# EAGLE schematic controller (EAGLE 6.6.0)

## Sheet 1 of 3: ESP
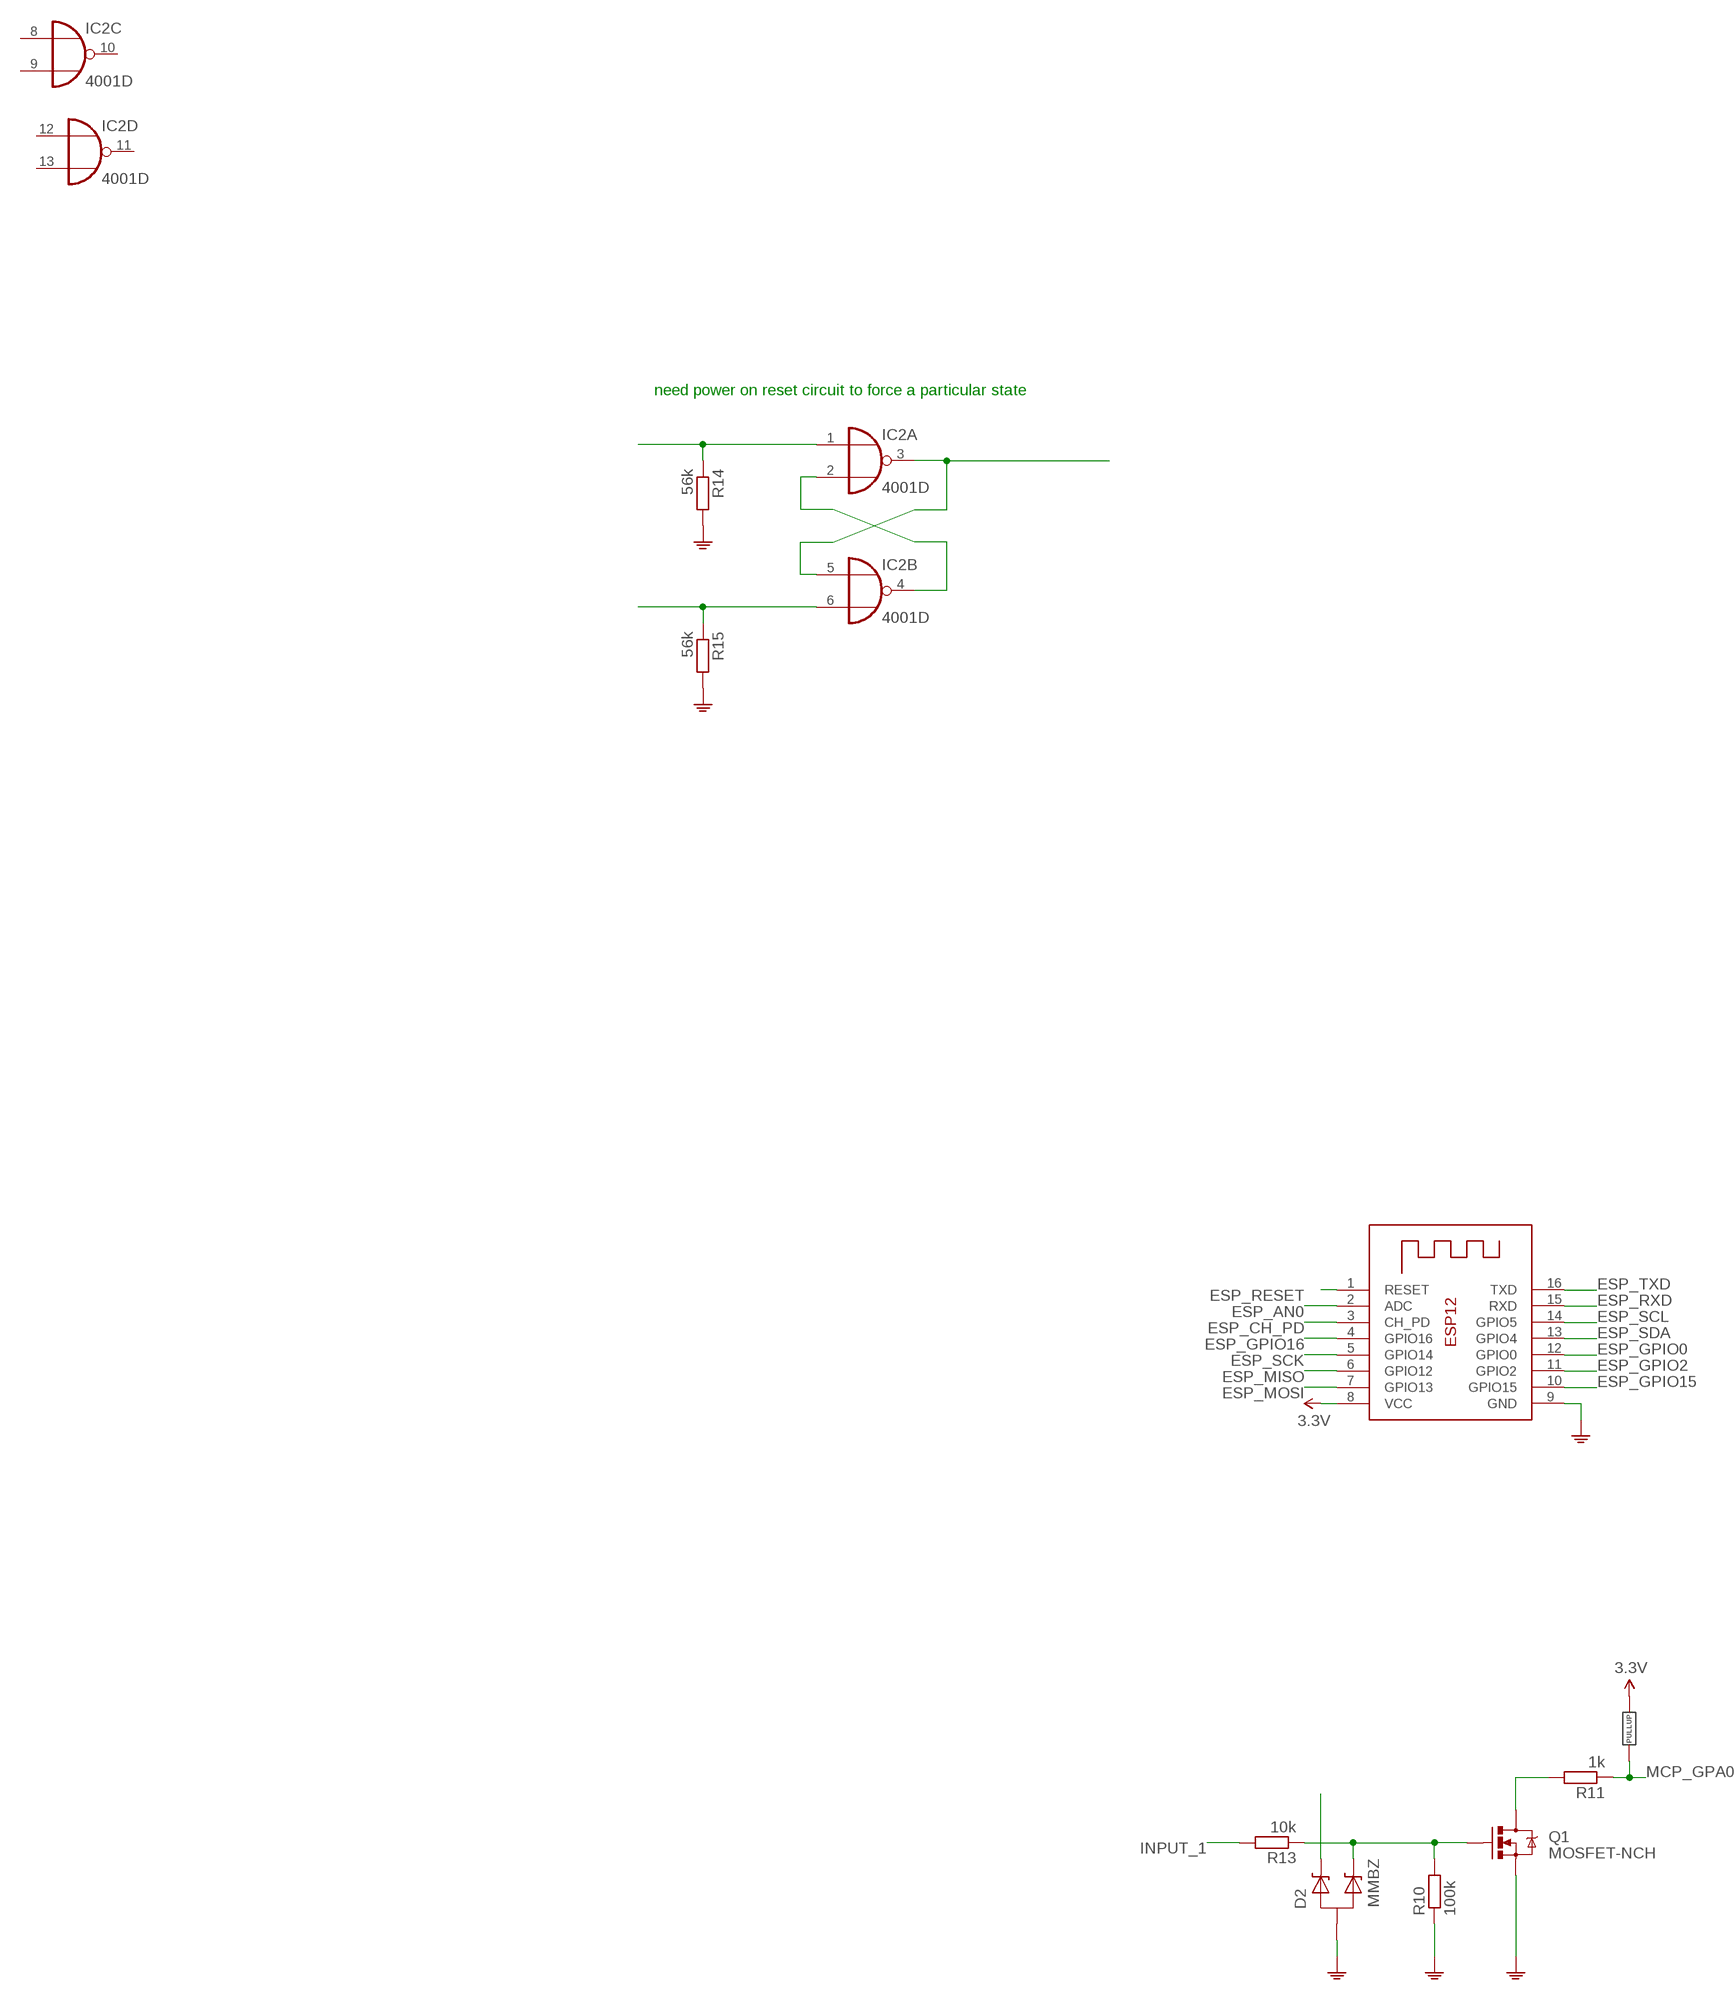
[diagram p0: schematic, sheet 1, part 1 of 2]
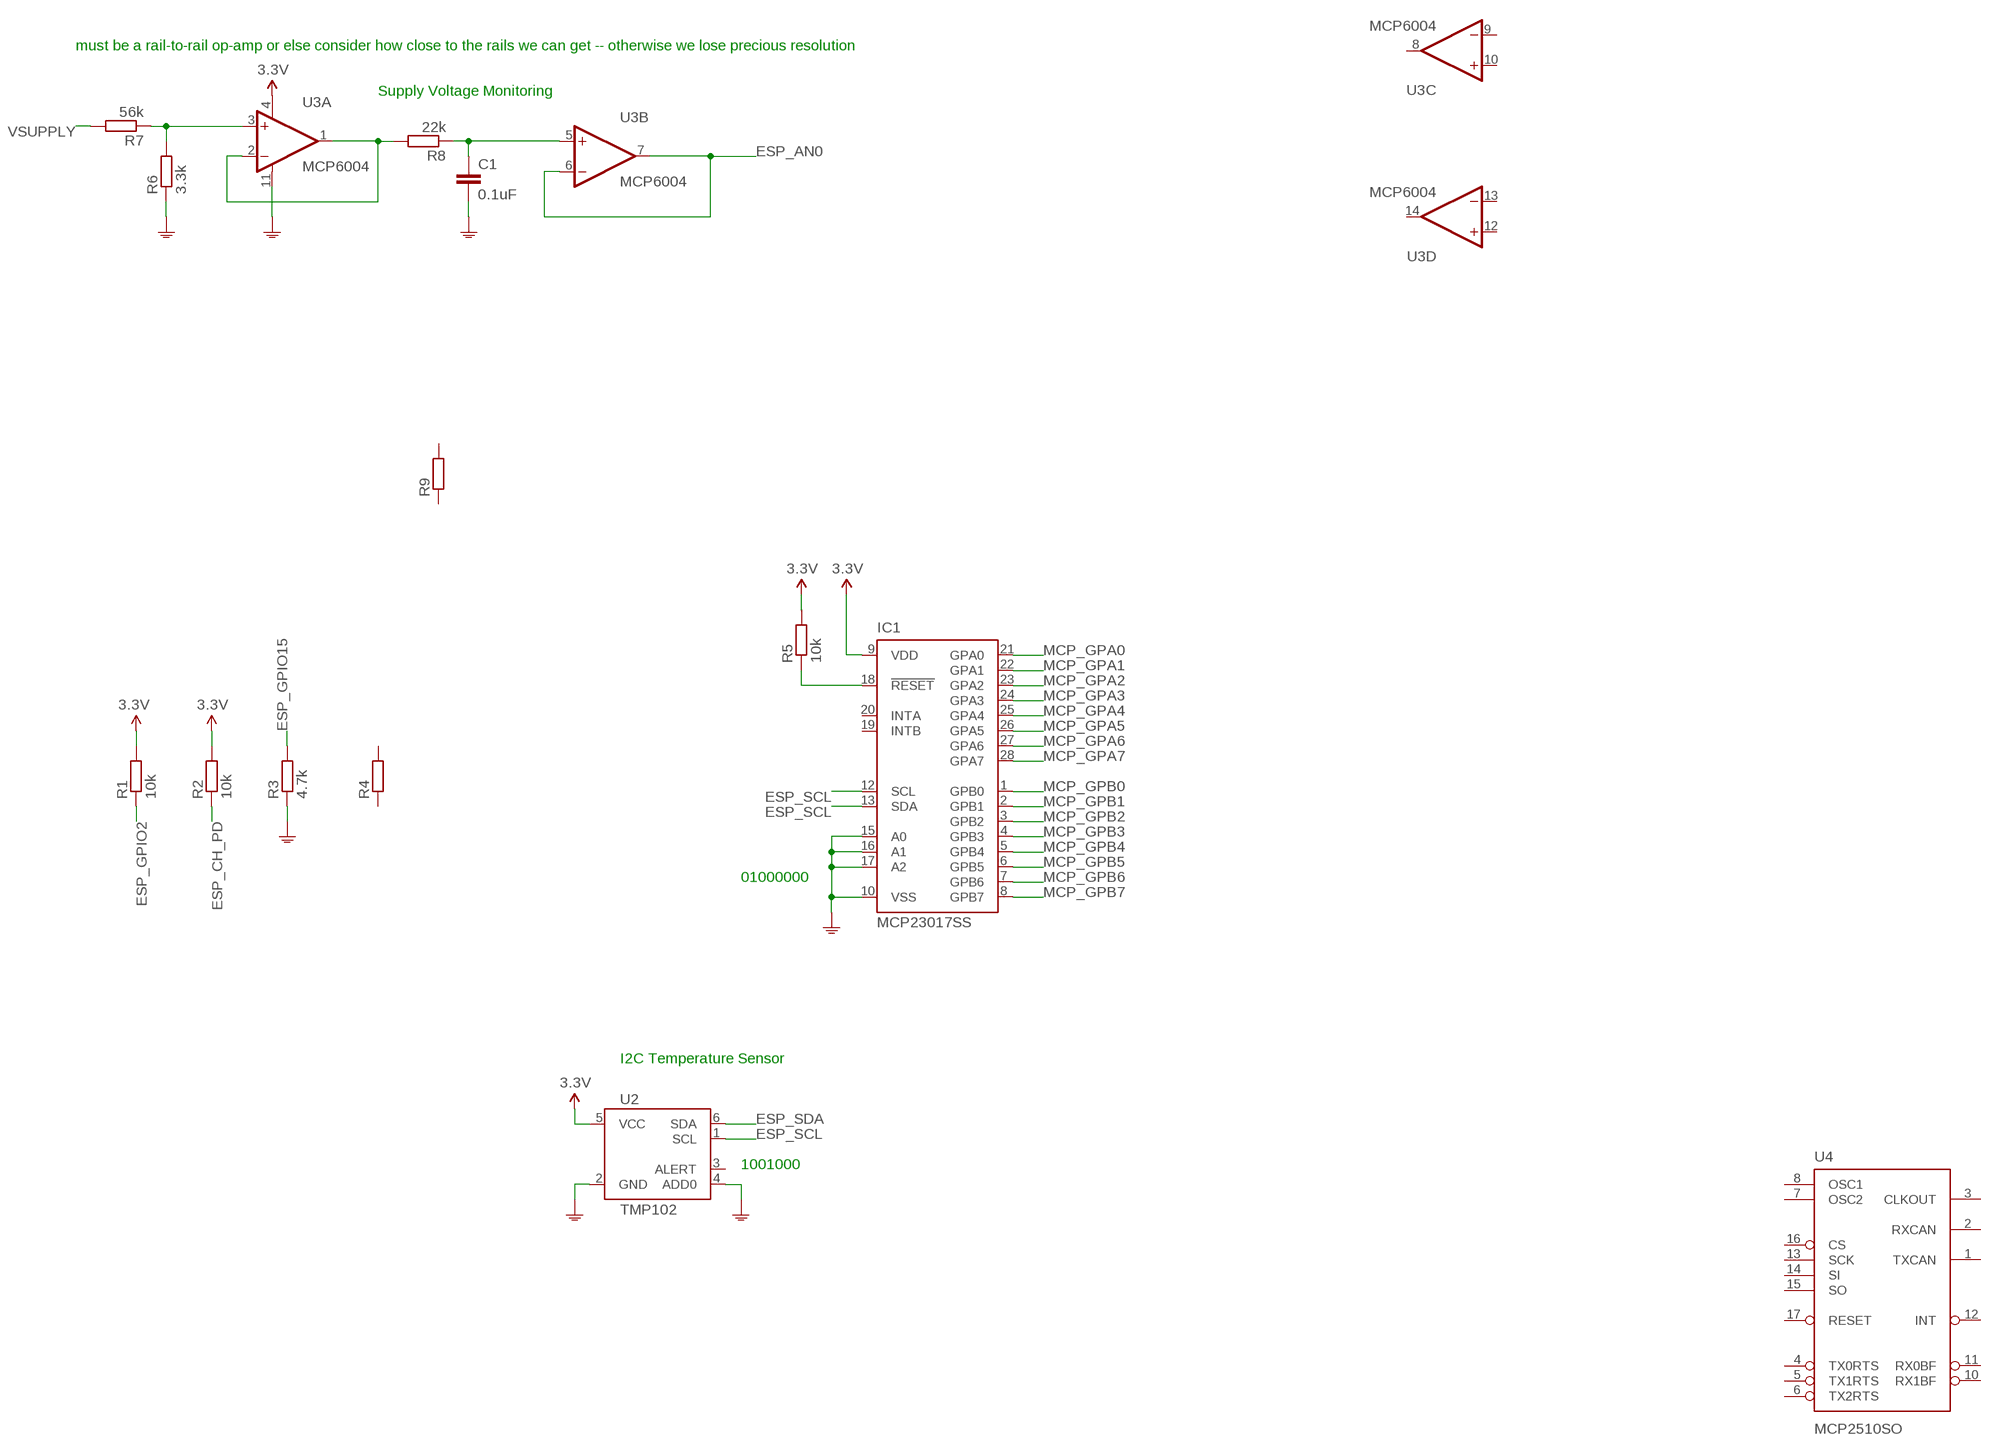
[diagram p1: schematic, sheet 1, part 2 of 2]

### Parts
C1  0.1uF  C-EUC0603K  [C0603K]
D2  MMBZ  MMBZ_SOT23  [SOT23]
IC1  MCP23017SS  [SSOP28]
IC2  4001D  [SO14]
Q1  MOSFET-NCH  MOSFET-NCHANNELAO3404A  [SOT23-3]
R1  10k  R-EU_R0603  [R0603]
R2  10k  R-EU_R0603  [R0603]
R3  4.7k  R-EU_R0603  [R0603]
R4  R-EU_R0603  [R0603]
R5  10k  R-EU_R0603  [R0603]
R6  3.3k  R-EU_R0603  [R0603]
R7  56k  R-EU_R0603  [R0603]
R8  22k  R-EU_R0603  [R0603]
R9  R-EU_R0603  [R0603]
R10  100k  R-EU_R0603  [R0603]
R11  1k  R-EU_R0603  [R0603]
R13  10k  R-EU_R0603  [R0603]
R14  56k  R-EU_R0603  [R0603]
R15  56k  R-EU_R0603  [R0603]
U2  TMP102  [SOT563]
U3  MCP6004  [TSSOP_14]
U4  MCP2510SO  [SO-18W]
U$1  RESISTOR_INTERNAL_PULLUP  (no package)
X1  ESP-12  [ESP-12]

### Nets
3.3V: IC1.9(VDD) R1.2 R2.2 R5.2 U2.5(VCC) U3.4(A:V+) U$1.P$2 X1.8(VCC)
ESP_AN0: U3.6(B:-IN) U3.7(B:OUT) X1.2(ADC)
ESP_CH_PD: R2.1 X1.3(CH_PD)
ESP_GPIO0: X1.12(GPIO0)
ESP_GPIO2: R1.1 X1.11(GPIO2)
ESP_GPIO15: R3.2 X1.10(GPIO15)
ESP_GPIO16: X1.4(GPIO16)
ESP_MISO: X1.6(GPIO12)
ESP_MOSI: X1.7(GPIO13)
ESP_RESET: X1.1(RESET)
ESP_RXD: X1.15(RXD)
ESP_SCK: X1.5(GPIO14)
ESP_SCL: IC1.12(SCL) IC1.13(SDA) U2.1(SCL) X1.14(GPIO5)
ESP_SDA: U2.6(SDA) X1.13(GPIO4)
ESP_TXD: X1.16(TXD)
GND: C1.2 D2.3(ANODE) IC1.10(VSS) IC1.15(A0) IC1.16(A1) IC1.17(A2) Q1.2(S) R3.1 R6.1 R10.1 R14.2 R15.2 U2.2(GND) U2.4(ADD0) U3.11(A:V-) X1.9(GND) ; also sheet 2,3
INPUT_1: R13.2 ; also sheet 2
INPUT_ACCESSORY: D2.2(CATHODE_2) Q1.1(G) R10.2 R13.1 ; also sheet 2
MCP_GPA0: IC1.21(GPA0) R11.1 U$1.P$1
MCP_GPA1: IC1.22(GPA1)
MCP_GPA2: IC1.23(GPA2)
MCP_GPA3: IC1.24(GPA3)
MCP_GPA4: IC1.25(GPA4)
MCP_GPA5: IC1.26(GPA5)
MCP_GPA6: IC1.27(GPA6)
MCP_GPA7: IC1.28(GPA7)
MCP_GPB0: IC1.1(GPB0)
MCP_GPB1: IC1.2(GPB1)
MCP_GPB2: IC1.3(GPB2)
MCP_GPB3: IC1.4(GPB3)
MCP_GPB4: IC1.5(GPB4)
MCP_GPB5: IC1.6(GPB5)
MCP_GPB6: IC1.7(GPB6)
MCP_GPB7: IC1.8(GPB7)
N$1: IC1.18(!RESET) R5.1
N$2: R6.2 R7.1 U3.3(A:+IN)
N$3: R8.2 U3.1(A:OUT) U3.2(A:-IN)
N$4: C1.1 R8.1 U3.5(B:+IN)
N$6: Q1.3(D) R11.2
N$9: D2.1(CATHODE_1)
N$13: IC2.3(A:O) IC2.5(B:I0)
N$15: IC2.1(A:I0) R14.1
N$16: IC2.6(B:I1) R15.1
N$17: IC2.2(A:I1) IC2.4(B:O)
VSUPPLY: R7.2 ; also sheet 2,3
Unconnected: IC1.19(INTB) IC1.20(INTA) IC2.8(C:I0) IC2.9(C:I1) IC2.10(C:O) IC2.11(D:O) IC2.12(D:I0) IC2.13(D:I1) R4.1 R4.2 R9.1 R9.2 U2.3(ALERT) U3.8(C:OUT) U3.9(C:-IN) U3.10(C:+IN) U3.12(D:+IN) U3.13(D:-IN) U3.14(D:OUT) U4.1(TXCAN) U4.2(RXCAN) U4.3(CLKOUT) U4.4(TX0RTS) U4.5(TX1RTS) U4.6(TX2RTS) U4.7(OSC2) U4.8(OSC1) U4.10(RX1BF) U4.11(RX0BF) U4.12(INT) U4.13(SCK) U4.14(SI) U4.15(SO) U4.16(CS) U4.17(RESET)

### Notes on the sheet
- must be a rail-to-rail op-amp or else consider how close to the rails we can get -- otherwise we lose precious resolution
- need power on reset circuit to force a particular state | Supply Voltage Monitoring
- 01000000
- I2C Temperature Sensor
- 1001000

## Sheet 2 of 3: Connectors
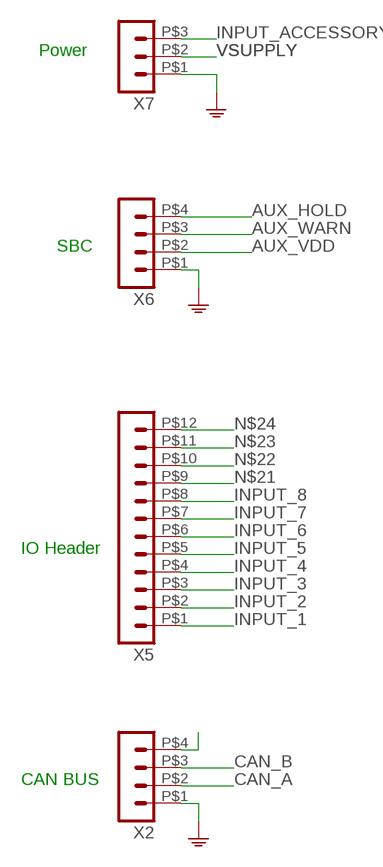
[diagram p2: schematic, sheet 2]

### Parts
X2  HEADER_POS4_43045-0401  [43045-0400]
X5  HEADER_POS12_43045-1200  [43045-1200]
X6  HEADER_POS4_43045-0401  [43045-0400]
X7  HEADER_POS3_43650-0300  [43650-0300]

### Nets
AUX_HOLD: X6.P$4
AUX_VDD: X6.P$2
AUX_WARN: X6.P$3
CAN_A: X2.P$2
CAN_B: X2.P$3
GND: X2.P$1 X6.P$1 X7.P$1 ; also sheet 1,3
INPUT_1: X5.P$1 ; also sheet 1
INPUT_2: X5.P$2
INPUT_3: X5.P$3
INPUT_4: X5.P$4
INPUT_5: X5.P$5
INPUT_6: X5.P$6
INPUT_7: X5.P$7
INPUT_8: X5.P$8
INPUT_ACCESSORY: X7.P$3 ; also sheet 1
N$12: X2.P$4
N$21: X5.P$9
N$22: X5.P$10
N$23: X5.P$11
N$24: X5.P$12
VSUPPLY: X7.P$2 ; also sheet 1,3

### Notes on the sheet
- Power
- SBC
- IO Header
- CAN BUS

## Sheet 3 of 3: Power
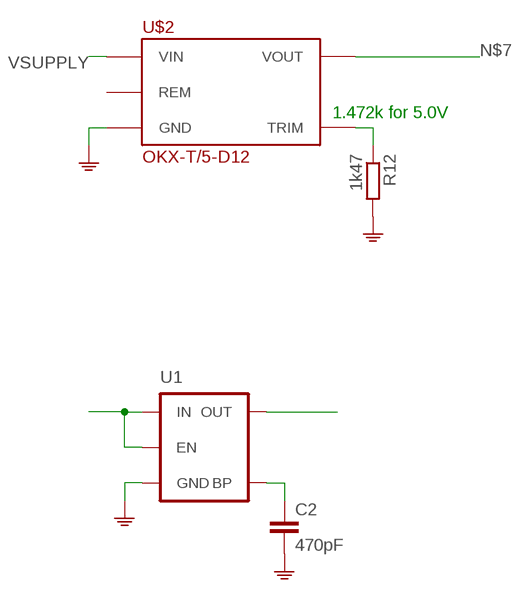
[diagram p3: schematic, sheet 3]

### Parts
C2  470pF  CAP0603  [R0603]
R12  1k47  R-EU_R0603  [R0603]
U1  MIC52053.3V  [SOT23-5]
U$2  OKX-T/5-D12  [OKX_SIP]

### Nets
GND: C2.2 R12.2 U1.2(GND) U$2.P$3(GND) ; also sheet 1,2
N$5: R12.1 U$2.P$2(TRIM)
N$7: U$2.P$1(VOUT)
N$8: U1.1(IN) U1.3(EN)
N$10: U1.5(OUT)
N$11: C2.1 U1.4(BP)
VSUPPLY: U$2.P$4(VIN) ; also sheet 1,2
Unconnected: U$2.P$5(REM)

### Notes on the sheet
- 1.472k for 5.0V

## Power pins joined to a net without a drawn wire
VDD: IC2.14(P:VDD) U4.18(VDD)
VSS: IC2.7(P:VSS) U4.9(VSS)

## Library data of the parts
C1 = rcl:C-EU: CAPACITOR, European symbol
C2 = curtek:CAP: Y CAPACITOR for power line
D2 = curtek:MMBZ
IC1 = microchip:MCP23017: http://ww1.microchip.com/downloads/en/DeviceDoc/21952a.pdf Source: http://ww1.microchip.com/downloads/en/DeviceDoc/21952a.pdf; MF: MICROCHIP; MPN: MCP23017-E/SS; OC_FARNELL: 1467674; OC_NEWARK: 31K2960
IC2 = 40xx:4001: Quad 2-input NOR
Q1 = SparkFun-DiscreteSemi:MOSFET-NCHANNEL: Common NMOSFET Parts MFG P/N Store ID Prod ID FDD8780 TRANS-09984 SI7820DN TRANS-11055 FDS6630A IC-08089 2N7002PW TRANS-11151 FQP30N06L COM-10213 TRANS-10060 BSS123LT1G TRANS-08345 BSS138 TRANS-00830 BS170 2N7000; PROD_ID: TRAN-12988
R1-R11 R13-R15 = rcl:R-EU_: RESISTOR, European symbol
R12 = curtek:R-EU_: RESISTOR, European symbol
U1 = SparkFun-PowerIC:MIC5205: MIC5205 150mA vreg 3.3V - VREG-00822 5V - VREG-00823; PROD_ID: VREG-00822
U2 = SparkFun-Sensors:TMP102: I2C degC temp sensor; PROD_ID: IC-09303
U3 = open-bldc:MCP6004
U4 = microchip_can:MCP2510
U$1 = curtek:RESISTOR_INTERNAL_PULLUP: Device to denote the presence of an external pull-up resistor. For schematic clarification; No associated footprint.
U$2 = curtek:OKX-T/5-D12
X1 = curtek:ESP-12
X2 X6 = con-molex-micro-fit-3_0:HEADER_POS4_?: Molex - Micro-Fit 3.0 Series connector, 3.00mm (0.118") pitch header, 4 positions.
X5 = con-molex-micro-fit-3_0:HEADER_POS12_?: Molex - Micro-Fit 3.0 Series connector, 3.00mm (0.118") pitch header, 12 positions.
X7 = con-molex-micro-fit-3_0:HEADER_POS3_?: Molex - Micro-Fit 3.0 Series connector, 3.00mm (0.118") pitch header, 3 positions.